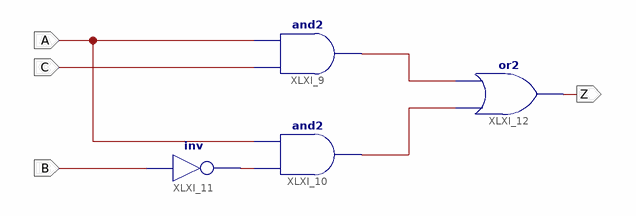
[diagram p0: schematic sheet 1]
// Xilinx ISE schematic ExamenP1ej2_v1.sch (spartan3) as structural Verilog: 4 symbols, 4 ports
module ExamenP1ej2_v1 (
  input  C,
  input  A,
  input  B,
  output Z
);

  wire XLXN_17, XLXN_22, XLXN_23;

  and XLXI_9 (XLXN_22, C, A);
  and XLXI_10 (XLXN_23, XLXN_17, A);
  not XLXI_11 (XLXN_17, B);
  or XLXI_12 (Z, XLXN_23, XLXN_22);
endmodule
